# Altium schematic sheet BlockDiagram.SchDoc
size A3; SheetNumber: 2; SheetTotal: 2
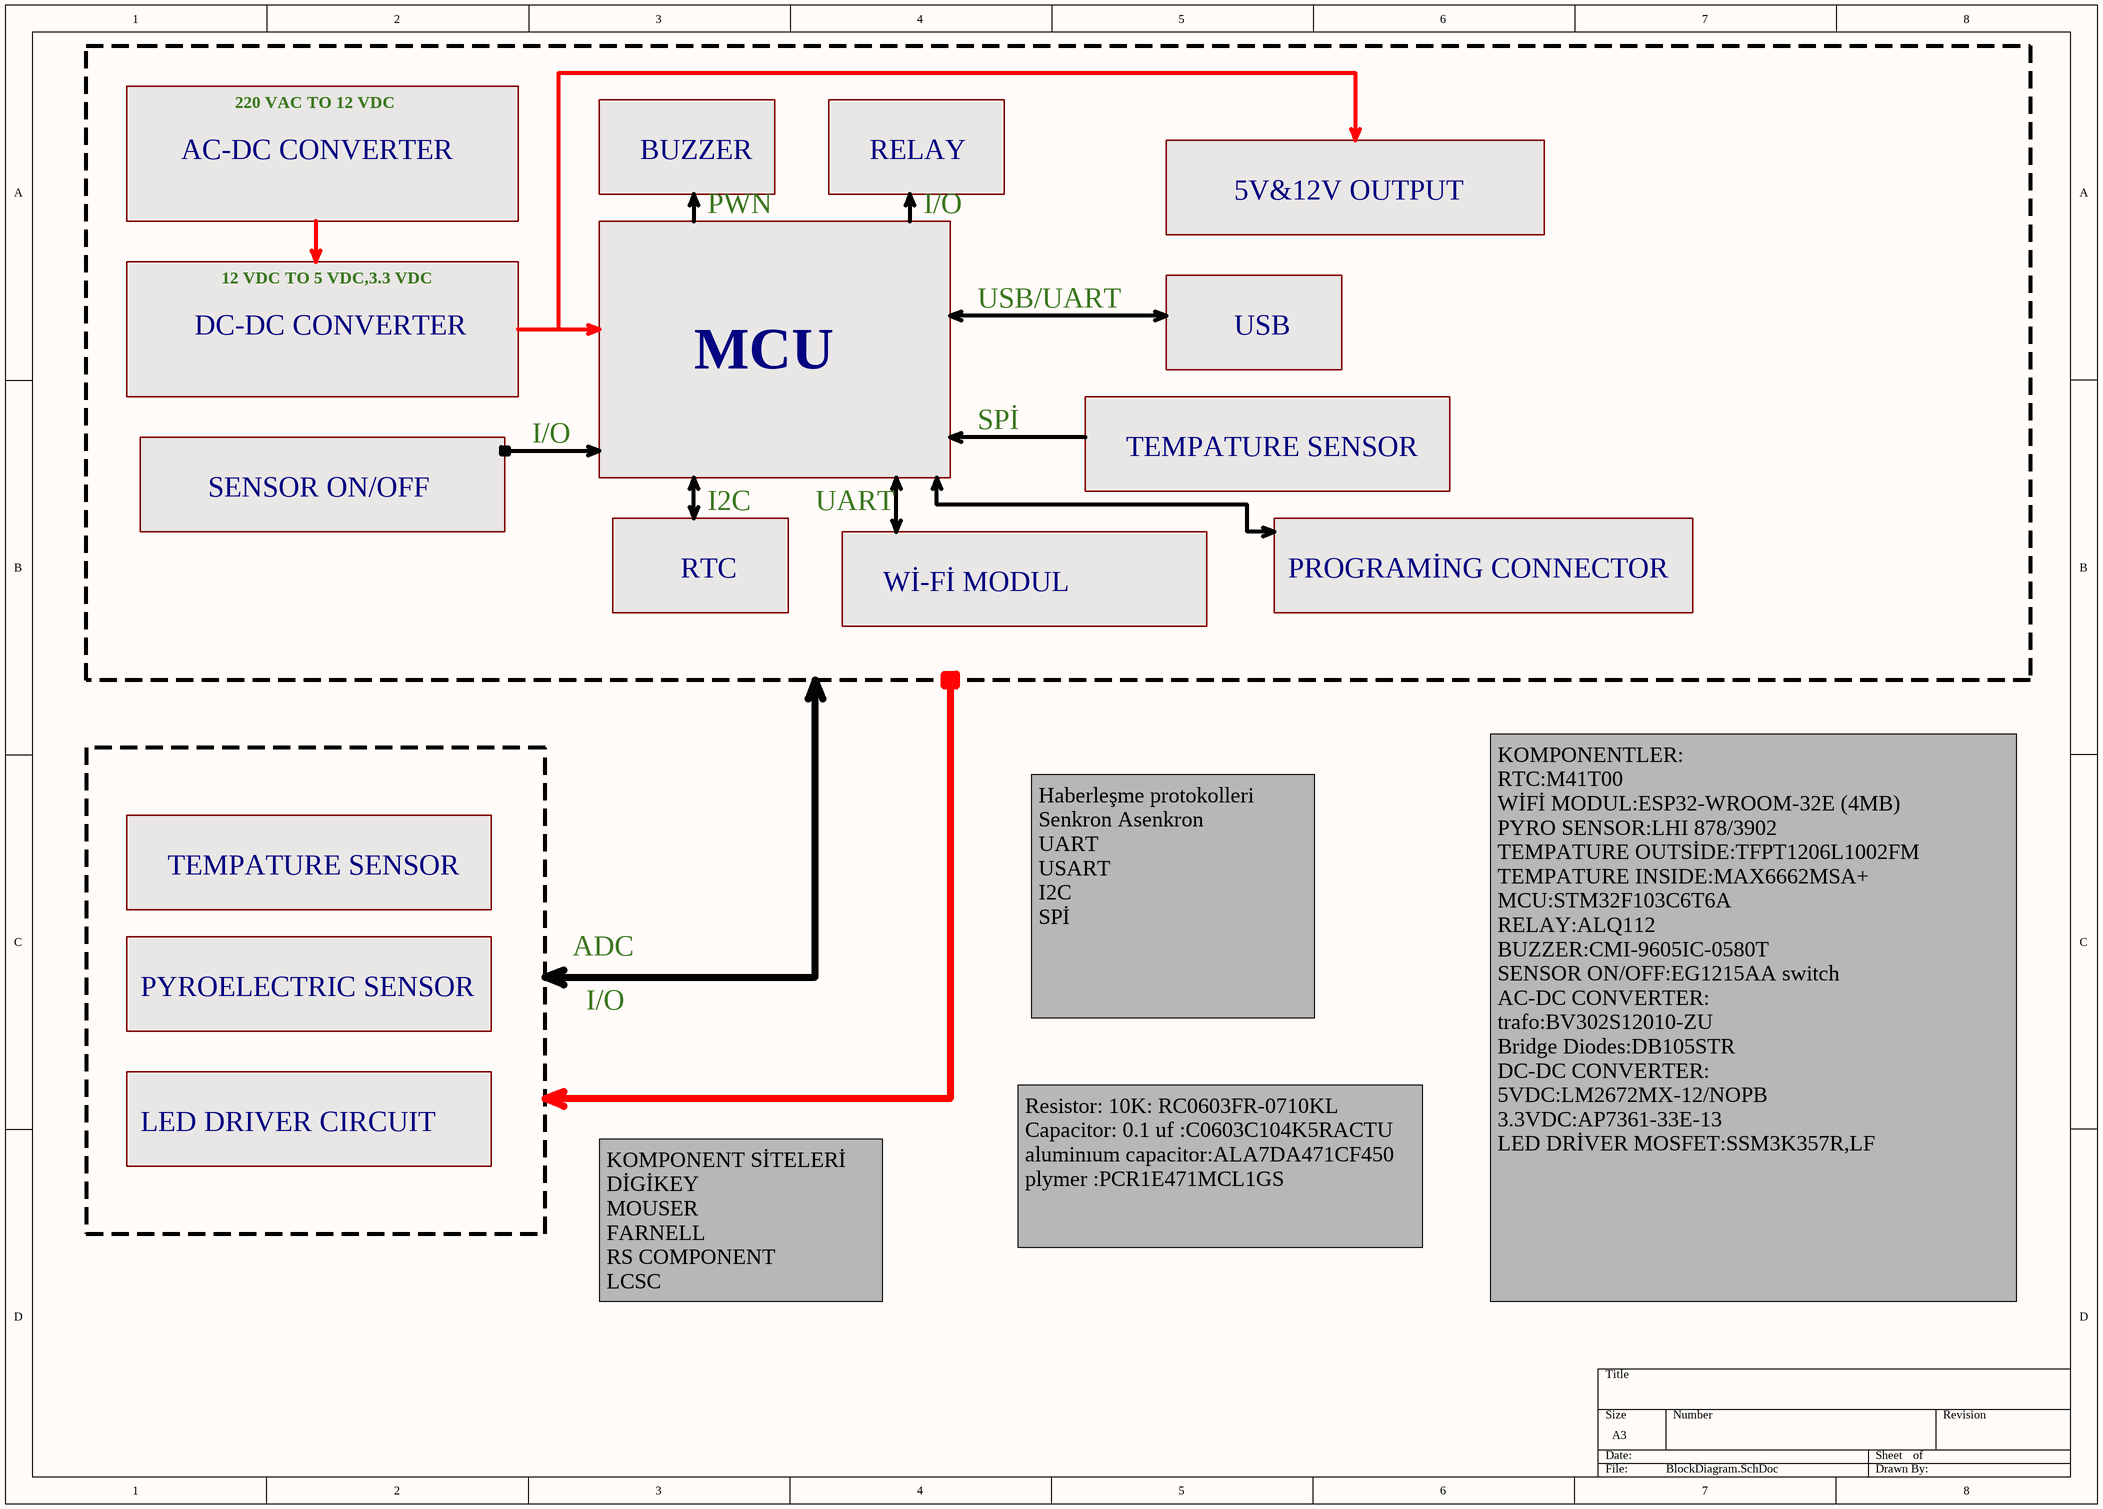
[diagram p0: BlockDiagram.SchDoc]

## Notes on the sheet
- 220 VAC TO 12 VDC
- AC-DC CONVERTER
- BUZZER
- RELAY
- PWN
- I/O
- 5V&12V OUTPUT
- 12 VDC TO 5 VDC,3.3 VDC
- USB/UART
- DC-DC CONVERTER
- MCU
- USB
- SPİ
- SENSOR ON/OFF
- I2C
- UART
- TEMPATURE SENSOR
- RTC
- PROGRAMİNG CONNECTOR
- Wİ-Fİ MODUL
- ADC
- PYROELECTRIC SENSOR
- Haberleşme protokolleri  Senkron Asenkron
  UART
  USART
  I2C
  SPİ
- LED DRIVER CIRCUIT
- Resistor: 10K: RC0603FR-0710KL
  Capacitor: 0.1 uf :C0603C104K5RACTU
  aluminıum capacitor:ALA7DA471CF450
  plymer :PCR1E471MCL1GS
- KOMPONENT SİTELERİ
  DİGİKEY
  MOUSER
  FARNELL
  RS COMPONENT
  LCSC
- KOMPONENTLER:
  RTC:M41T00
  WİFİ MODUL:ESP32-WROOM-32E (4MB)
  PYRO SENSOR:LHI 878/3902
  TEMPATURE OUTSİDE:TFPT1206L1002FM
  TEMPATURE INSIDE:MAX6662MSA+
  MCU:STM32F103C6T6A
  RELAY:ALQ112
  BUZZER:CMI-9605IC-0580T
  SENSOR ON/OFF:EG1215AA switch
  AC-DC CONVERTER:
  trafo:BV302S12010-ZU
  Bridge Diodes:DB105STR
  DC-DC CONVERTER:
  5VDC:LM2672MX-12/NOPB
  3.3VDC:AP7361-33E-13
  LED DRİVER MOSFET:SSM3K357R,LF